# EAGLE design pc_healthypi_move_nRF5340_v2 (EAGLE 9.6.2)
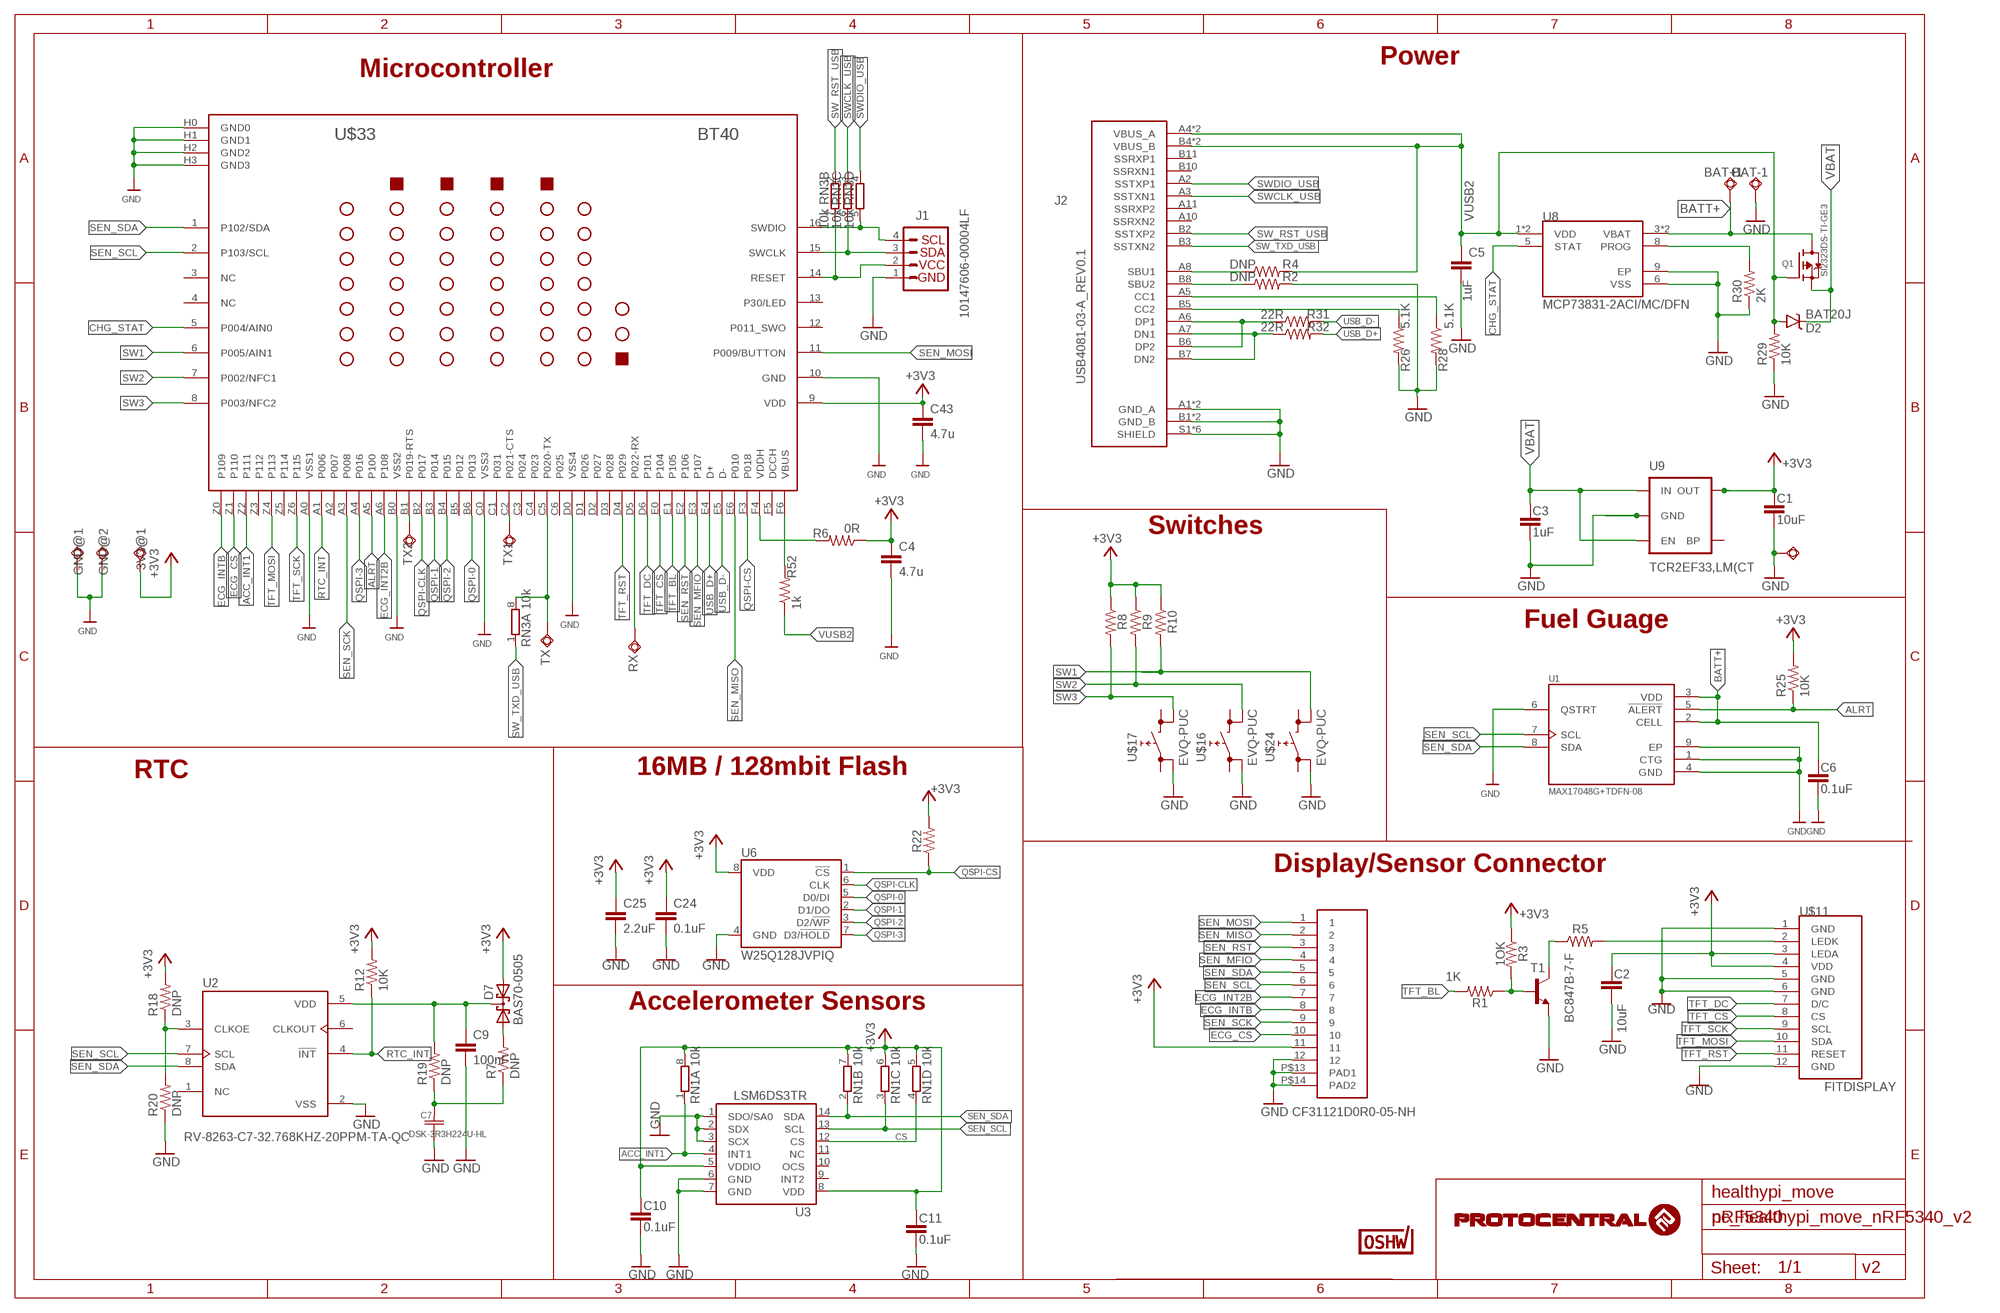
[diagram p0: schematic, sheet 1]

## Parts
3V3@1  TPSQTP13SQ  [TP13SQ]
BAT+1  TPSQTP13SQ  [TP13SQ]
BAT-1  TPSQTP13SQ  [TP13SQ]
C1  10uF  0.1UF-0603-100V-10%  [0603@1]
C2  10uF  0.1UF-0603-100V-10%  [0603@1]
C3  1uF  0.1UF-0402T-6.3V-10%-X7R  [0402-TIGHT]
C4  4.7u  C-EUC0402  [C0402]
C5  1uF  2.2UF-0402_TIGHT-10V-10%-X5R  [0402-TIGHT]
C6  0.1uF  0.1UF-0402T-6.3V-10%-X7R  [0402-TIGHT]
C7  DSK-3R3H224U-HL  [CAP_DSK-3R3H224U-HL_ELN]
C9  100nF  C-EUC0402  [C0402]
C10  0.1uF  0.1UF-0402T-6.3V-10%-X7R  [0402-TIGHT]
C11  0.1uF  0.1UF-0402T-6.3V-10%-X7R  [0402-TIGHT]
C24  0.1uF  0.1UF-0402T-6.3V-10%-X7R  [0402-TIGHT]
C25  2.2uF  2.2UF-0402_TIGHT-10V-10%-X5R  [0402-TIGHT]
C43  4.7u  C-EUC0402  [C0402]
D2  BAT20J  DIODE-SCHOTTKY-BAT20J  [SOD-323]
D7  BAS70-0505  [SOT23]
GND@1  TPSQTP13SQ  [TP13SQ]
GND@2  TPSQTP13SQ  [TP13SQ]
J1  10147606-00004LF  QWIIC_CONNECTORJS-1MM  [JST04_1MM_RA]
J2  USB4081-03-A_REV0.1  [GCT_USB4081-03-A_REV0.1]
Q1  SI2323DS-TI-GE3  MOSFET-P  [SOT23-R]
R1  200  R-US_R0402  [R0402]
R2  DNP  RESISTOR0402-RES  [0402-RES]
R3  200  R-US_R0402  [R0402]
R4  DNP  RESISTOR0402-RES  [0402-RES]
R5  200R  R-US_R0402  [R0402]
R6  0R  RESISTOR0402-RES  [0402-RES]
R7  DNP  R-US_R0402  [R0402]
R8  200  R-US_R0402  [R0402]
R9  200  R-US_R0402  [R0402]
R10  200  R-US_R0402  [R0402]
R12  10K  R-US_R0402  [R0402]
R18  DNP  R-US_R0402  [R0402]
R19  DNP  R-US_R0402  [R0402]
R20  DNP  R-US_R0402  [R0402]
R22  10k  R-US_R0402  [R0402]
R25  10K  RESISTOR0402-RES  [0402-RES]
R26  5.1K  RESISTOR0402-RES  [0402-RES]
R28  5.1K  RESISTOR0402-RES  [0402-RES]
R29  10K  R-US_R0402  [R0402]
R30  2K  R-US_R0402  [R0402]
R31  22R  RESISTOR0402-RES  [0402-RES]
R32  22R  RESISTOR0402-RES  [0402-RES]
R52  1k  RESISTOR0402-RES  [0402-RES]
RN1  10k  4R-N0402ARV341  [4X0402ARV341]
RN3  10k  4R-N0402ARV341  [4X0402ARV341]
RX  TPSQTP13SQ  [TP13SQ]
SWIO6  TPSQTP11R  [TP11R]
T1  BC847B-7-F  MMBT2222ALT1-NPN-SOT23-BEC  [SOT23-BEC]
TX  TPSQTP13SQ  [TP13SQ]
TX1  TPSQTP13SQ  [TP13SQ]
TX2  TPSQTP13SQ  [TP13SQ]
U1  MAX17048G+TDFN-08  [SON50P200X200X80-9N]
U2  RV-8263-C7-32.768KHZ-20PPM-TA-QC  [IC_RV-8263-C7-32.768KHZ-20PPM-TA-QC]
U3  LSM6DS3TR  LSM6DS3  [LGA14L]
U6  W25Q128JVPIQ  W25QXX128MBIT-6X5-SKINNY_CENTER  [WSON-8-6X5-SKINNY_CENTERPAD]
U8  MCP73831-2ACI/MC/DFN  [SON50P200X300X100-9N]
U9  TCR2EF33,LM(CT  V_REG_LDOSMD  [SOT23-5]
U$5  CF31121D0R0-05-NH  [CF31121D0R0-05-NH]
U$9  CERT-SMALL  [CERT-SMALL-SILK]
U$11  FITDISPLAY  [FITDISPLAY]
U$16  EVQ-PUC  [EVQ-PUC]
U$17  EVQ-PUC  [EVQ-PUC]
U$24  EVQ-PUC  [EVQ-PUC]
U$33  BT40  [BT40]

## Nets
+3V3: 3V3@1.TP C1.1 C2.1 C4.1 C10.1 C11.1 C24.1 C25.1 C43.1 D7.2(A2) R3.1 R6.1 R8.1 R9.1 R10.1 R12.2 R18.2 R22.2 R25.2 RN1.5 RN1.6 RN1.7 RN1.8 U3.5(VDDIO) U3.8(VDD) U6.8(VDD) U9.5(OUT) U$5.11 U$11.3(LEDA) U$11.4(VDD) U$33.9(VDD)
ACC_INT1: RN1.1 U3.4(INT1) U$33.Z2(P111)
ALRT: R25.1 U1.5(!ALERT) U$33.A5(P100)
BATT+: BAT+1.TP C6.1 Q1.3(D) U1.2(CELL) U1.3(VDD) U8.3(VBAT) U8.4(VBAT)
CHG_STAT: U8.5(STAT) U$33.5(P004/AIN0)
CS: RN1.4 U3.12(CS)
ECG_CS: U$5.10 U$33.Z1(P110)
ECG_INT2B: U$5.7 U$33.A6(P108)
ECG_INTB: U$5.8 U$33.Z0(P109)
GND: BAT-1.TP C1.2 C2.2 C3.2 C4.2 C5.2 C6.2 C7.1 C9.2 C10.2 C11.2 C24.2 C25.2 C43.2 GND@1.TP GND@2.TP J1.1 J2.A1(GND_A) J2.A12(GND_A) J2.B1(GND_B) J2.B12(GND_B) J2.S1(SHIELD) J2.S2(SHIELD) J2.S3(SHIELD) J2.S4(SHIELD) J2.S5(SHIELD) J2.S6(SHIELD) R2.2 R20.1 R26.2 R28.2 R29.1 R30.1 SWIO6.TP T1.E U1.1(CTG) U1.4(GND) U1.6(QSTRT) U1.9(EP) U2.2(VSS) U3.1(SDO/SA0) U3.2(SDX) U3.3(SCX) U3.6(GND) U3.7(GND) U6.4(GND) U8.6(VSS) U8.9(EP) U9.2(GND) U$5.12 U$5.P$13(PAD1) U$5.P$14(PAD2) U$11.1(GND) U$11.5(GND) U$11.6(GND) U$11.12(GND) U$16.3 U$17.3 U$24.3 U$33.10(GND) U$33.A0(VSS1) U$33.B0(VSS2) U$33.C0(VSS3) U$33.D0(VSS4) U$33.H0(GND0) U$33.H1(GND1) U$33.H2(GND2) U$33.H3(GND3)
N$1: J2.B8(SBU2) R2.1
N$2: J2.A8(SBU1) R4.1
N$3: TX2.TP U$33.B1(P019-RTS)
N$4: J2.B5(CC2) R26.1
N$5: TX1.TP U$33.C2(P021-CTS)
N$6: J2.A5(CC1) R28.1
N$7: R30.2 U8.8(PROG)
N$8: J2.A6(DP1) J2.B6(DP2) R31.1
N$9: J2.A7(DN1) J2.B7(DN2) R32.1
N$18: R5.2 U$11.2(LEDK)
N$21: R5.1 T1.C
N$23: R1.1 R3.2 T1.B
N$25: R52.2 U$33.F6(VBUS)
N$26: R6.2 U$33.F4(VDDH)
N$30: C9.1 D7.3(K1K2) R19.2 U2.5(VDD)
N$31: R18.1 R20.2 U2.3(CLKOE)
N$32: D7.1(A1) R7.2
N$33: C7.2 R7.1 R19.1
QSPI-0: U6.5(D0/DI) U$33.B6(P013)
QSPI-1: U6.2(D1/DO) U$33.B3(P014)
QSPI-2: U6.3(D2/!WP!) U$33.B4(P015)
QSPI-3: U6.7(D3/!HOLD!) U$33.A4(P016)
QSPI-CLK [Clock]: U6.6(CLK) U$33.B2(P017)
QSPI-CS: R22.1 U6.1(!CS!) U$33.F3(P018)
RESET1: J1.2 RN3.7 U$33.14(RESET)
RTC_INT: R12.1 U2.4(!INT) U$33.A1(P006)
SEN_MFIO: U$5.4 U$33.E3(P107)
SEN_MISO: U$5.2 U$33.E6(P010)
SEN_MOSI: U$5.1 U$33.11(P009/BUTTON)
SEN_RST: U$5.3 U$33.E2(P106)
SEN_SCK: U$5.9 U$33.A3(P008)
SEN_SCL: RN1.3 U1.7(SCL) U2.7(SCL) U3.13(SCL) U$5.6 U$33.2(P103/SCL)
SEN_SDA: RN1.2 U1.8(SDA) U2.8(SDA) U3.14(SDA) U$5.5 U$33.1(P102/SDA)
SW1: R10.2 U$24.2 U$33.6(P005/AIN1)
SW2: R9.2 U$16.2 U$33.7(P002/NFC1)
SW3: R8.2 U$17.2 U$33.8(P003/NFC2)
SW_RST_USB: J2.B2(SSTXP2) RN3.2
SW_TXD_USB: J2.B3(SSTXN2) RN3.1
SWCLK1: J1.3 RN3.6 U$33.15(SWCLK)
SWCLK_USB: J2.A3(SSTXN1) RN3.3
SWDIO1: J1.4 RN3.5 U$33.16(SWDIO)
SWDIO_USB: J2.A2(SSTXP1) RN3.4
TFT_BL: R1.2 U$33.E1(P105)
TFT_CS: U$11.8(CS) U$33.E0(P104)
TFT_DC: U$11.7(D/C) U$33.D6(P101)
TFT_MOSI: U$11.10(SDA) U$33.Z4(P113)
TFT_RST: U$11.11(RESET) U$33.D4(P029)
TFT_SCK: U$11.9(SCL) U$33.Z6(P115)
UART_RX: RX.TP U$33.D5(P022-RX)
UART_TX: RN3.8 TX.TP U$33.C5(P020-TX)
USB_D+: R32.2 U$33.E4(D+)
USB_D-: R31.2 U$33.E5(D-)
VBAT: C3.1 D2.C Q1.2(S) U9.1(IN) U9.3(EN)
VUSB2: C5.1 D2.A J2.A4(VBUS_A) J2.A9(VBUS_A) J2.B4(VBUS_B) J2.B9(VBUS_B) Q1.1(G) R4.2 R29.2 R52.1 U8.1(VDD) U8.2(VDD)
Unconnected: J2.A10(SSRXN2) J2.A11(SSRXP2) J2.B10(SSRXN1) J2.B11(SSRXP1) U2.1(NC) U2.6(CLKOUT) U3.9(INT2) U3.10(OCS) U3.11(NC) U9.4(BP) U$16.1 U$16.4 U$17.1 U$17.4 U$24.1 U$24.4 U$33.3(NC) U$33.4(NC) U$33.12(P011_SWO) U$33.13(P30/LED) U$33.A2(P007) U$33.B5(P012) U$33.C1(P031) U$33.C3(P024) U$33.C4(P023) U$33.C6(P025) U$33.D1(P026) U$33.D2(P027) U$33.D3(P028) U$33.F5(DCCH) U$33.Z3(P112) U$33.Z5(P114)

## Notes on the sheet
- Power
- Microcontroller
- Switches
- Fuel Guage
- 16MB / 128mbit Flash
- RTC
- Display/Sensor Connector
- 1OK
- 1K
- Accelerometer Sensors
- CF31121D0R0-05-NH
- healthypi_move
- nRF5340
- v2

## Library data of the parts
3V3@1 BAT+1 BAT-1 GND@1 GND@2 RX SWIO6 TX TX1 TX2 = testpad:TPSQ: Test pad
C1 C2 = SparkFun-Capacitors:0.1UF: 0.1µF ceramic capacitors A capacitor is a passive two-terminal electrical component used to store electrical energy temporarily in an electric field.; PROD_ID: CAP-08390; VALUE: 0.1uF
C3 = SparkFun-Capacitors:0.1UF: 0.1µF ceramic capacitors A capacitor is a passive two-terminal electrical component used to store electrical energy temporarily in an electric field.; PROD_ID: CAP-14993; VALUE: 0.1uF
C4 C9 C43 = rcl:C-EU: CAPACITOR, European symbol; SPICEPREFIX: C
C5 = SparkFun-Capacitors:2.2UF: 2.2µF ceramic capacitors A capacitor is a passive two-terminal electrical component used to store electrical energy temporarily in an electric field.; PROD_ID: CAP-14232; VALUE: 2.2uF
C6 C10 C11 C24 = SparkFun-Capacitors:0.1UF: 0.1µF ceramic capacitors A capacitor is a passive two-terminal electrical component used to store electrical energy temporarily in an electric field.; PROD_ID: CAP-14993
C7 = circuitects:DSK-3R3H224U-HL; COPYRIGHT: Copyright (C) 2023 Ultra Librarian. All rights reserved.; MANUFACTURER_PART_NUMBER: DSK-3R3H224U-HL; MFR_NAME: Elna
C25 = SparkFun-Capacitors:2.2UF: 2.2µF ceramic capacitors A capacitor is a passive two-terminal electrical component used to store electrical energy temporarily in an electric field.; PROD_ID: CAP-14232
D2 = SparkFun-DiscreteSemi:DIODE-SCHOTTKY: Schottky diodes in SFE's production catalog BAT20J 1A 23V 0.62Vf RB751 120mA 40V 0.37Vf PMEG4005EJ 0.5A 40V 0.42Vf MBRA140 1A 40V 0.5Vf B340A 3A 40V SMA; PROD_ID: DIO-11623
D7 = circuitects:BAS70-05: General-purpose Schottky diodes General-purpose Schottky diodes in small Surface-Mounted Device (SMD) plastic packages AAL Eindhoven MK Check availability <https://pricing.snapeda.com/parts/BAS70-05/Diotec/view-part?ref=eda>; AVAILABILITY: In Stock; CHECK_PRICES: https://www.snapeda.com/parts/BAS70-05/Diotec/view-part/?ref=eda; DESCRIPTION: Schottky, SOT-23, 70V, 0.07A, 150C; MF: Diotec; MP: BAS70-05; PACKAGE: SOT-23-3 Diotec; PRICE: None; SNAPEDA_LINK: https://www.snapeda.com/parts/BAS70-05/Diotec/view-part/?ref=snap
J1 = SparkFun-Connectors:QWIIC_CONNECTOR: SparkFun I2C Standard Qwiic Connector An SMD 1mm pitch JST connector makes it easy and quick (get it? Qwiic?) to connect I2C devices to each other. The Qwiic system <http://www.sparkfun.com/qwiic> enables fast and solderless connection between popular platforms and various sensors and actuators. We carry 200mm <https://www.sparkfun.com/products/14204>, 100mm <https://www.sparkfun.com/products/14205>, 50mm <https://www.sparkfun.com/products/14206>, and breadboard friendly <https://www.sparkfun.com/products/14207> Qwiic cables. We also offer 10 pcs strips <https://www.sparkfun.com/products/14323> the SMD connectors.; PROD_ID: CONN-13694; VALUE: QWIIC_RIGHT_ANGLE
J2 = circuitects:USB4081-03-A_REV0.1: Check availability <https://pricing.snapeda.com/parts/USB4081-03-A/Global%20Connector%20Technology/view-part?ref=eda>; AVAILABILITY: In Stock; DESCRIPTION: Type C USB 3.2 Gen 2 Connector; MF: Global Connector Technology; MP: USB4081-03-A; PACKAGE: None; PRICE: None
Q1 = microbuilder:MOSFET-P: P-Channel Mosfet SOT-23 IRLML5103 30V 760mA 1V Vgs - Digikey: IRLML5103PBFCT-ND NTR0202PL 20V 400mA 2.3V Vgs - Digikey: NTR0202PLT1GOSTR-ND NTR4101PT1G 20V 1.8A 1.2V Vgs - Digikey: NTR4101PT1GOSCT-ND DMP2004K 20V 600mA 1V Vgs - Digikey: DMP2004KDICT-ND
R1 R3 R5 R7-R10 R12 R18-R20 R22 R29 R30 = rcl:R-US_: RESISTOR, American symbol; SPICEPREFIX: R
R2 R4 R6 R25 R26 R28 R31 R32 R52 = SparkFun:RESISTOR: Resistor Basic schematic elements and footprints for 0603, 1206, and PTH resistors.
RN1 RN3 = resistor-dil:4R-N: Array Chip Resistor Source: RS Component / Phycomp; OC_FARNELL: unknown; OC_NEWARK: unknown
T1 = transistor:*-NPN-: NPN Transistror BF959 corrected 2008.03.06
U1 = circuitects:MAX17048G+: Micropower 1-Cell/2-Cell Li+ ModelGauge ICs Check availability <https://pricing.snapeda.com/parts/MAX17048G%2B/Analog%20Devices/view-part?ref=eda>; AVAILABILITY: In Stock; DESCRIPTION: 3µA 1-Cell/2-Cell Fuel Gauge with ModelGauge; MF: Analog Devices; MP: MAX17048G+; PACKAGE: TDFN-8 Maxim; PRICE: None; PURCHASE-URL: https://pricing.snapeda.com/search/part/MAX17048G+/?ref=eda
U2 = circuitects:RV-8263-C7-32.768KHZ-20PPM-TA-QC: Check availability <https://pricing.snapeda.com/parts/RV-8263-C7-32.768KHZ-20PPM-TA-QC/Micro%20Crystal/view-part?ref=eda>; AVAILABILITY: In Stock; CHECK_PRICES: https://www.snapeda.com/parts/RV-8263-C7-32.768KHZ-20PPM-TA-QC/Micro+Crystal/view-part/?ref=eda; DESCRIPTION: Real-Time Clock Module in 1.5 x 3.2 mm package; MF: Micro Crystal; MP: RV-8263-C7-32.768KHZ-20PPM-TA-QC; PACKAGE: QFN-8 Micro Crystal; PRICE: None; SNAPEDA_LINK: https://www.snapeda.com/parts/RV-8263-C7-32.768KHZ-20PPM-TA-QC/Micro+Crystal/view-part/?ref=snap
U3 = LSM6DS3:LSM6DS3
U6 = SparkFun-IC-Memory:W25QXX; PROD_ID: IC-15107
U8 = circuitects:MCP73831-2ACI/MC/DFN: MCP73831 Series Single-Cell Li-Ion/Li-Polymer Battery Charge Controller - DFN-8 Check availability <https://pricing.snapeda.com/parts/MCP73831-2ACI/MC/Microchip%20Technology/view-part?ref=eda>; AVAILABILITY: In Stock; DESCRIPTION: Linear Battery Charger Controller Li-Ion/Li-Pol 505mA 4.2V 8-Pin DFN EP Tube; MF: Microchip Technology; MP: MCP73831-2ACI/MC; PACKAGE: None; PRICE: None; PURCHASE-URL: https://pricing.snapeda.com/search/part/MCP73831-2ACI/MC/?ref=eda
U9 = SparkFun-PowerIC:V_REG_LDO: Voltage Regulator LDO Standard 150mA LDO voltage regulator in SOT-23 layout. Micrel part MIC5205. BP (by-pass) pin is used to lower output noise with 470pF cap.; PROD_ID: VREG-12457
U$5 = circuitects:CF31121D0R0-05-NH
U$9 = OSHWA:CERT
U$11 = circuitects:FITDISPLAY
U$16 U$17 U$24 = circuitects:EVQ-PUC
U$33 = circuitects:BT40

## Net classes
2 Clock: width 0.089 mm, clearance 0.178 mm

## Board
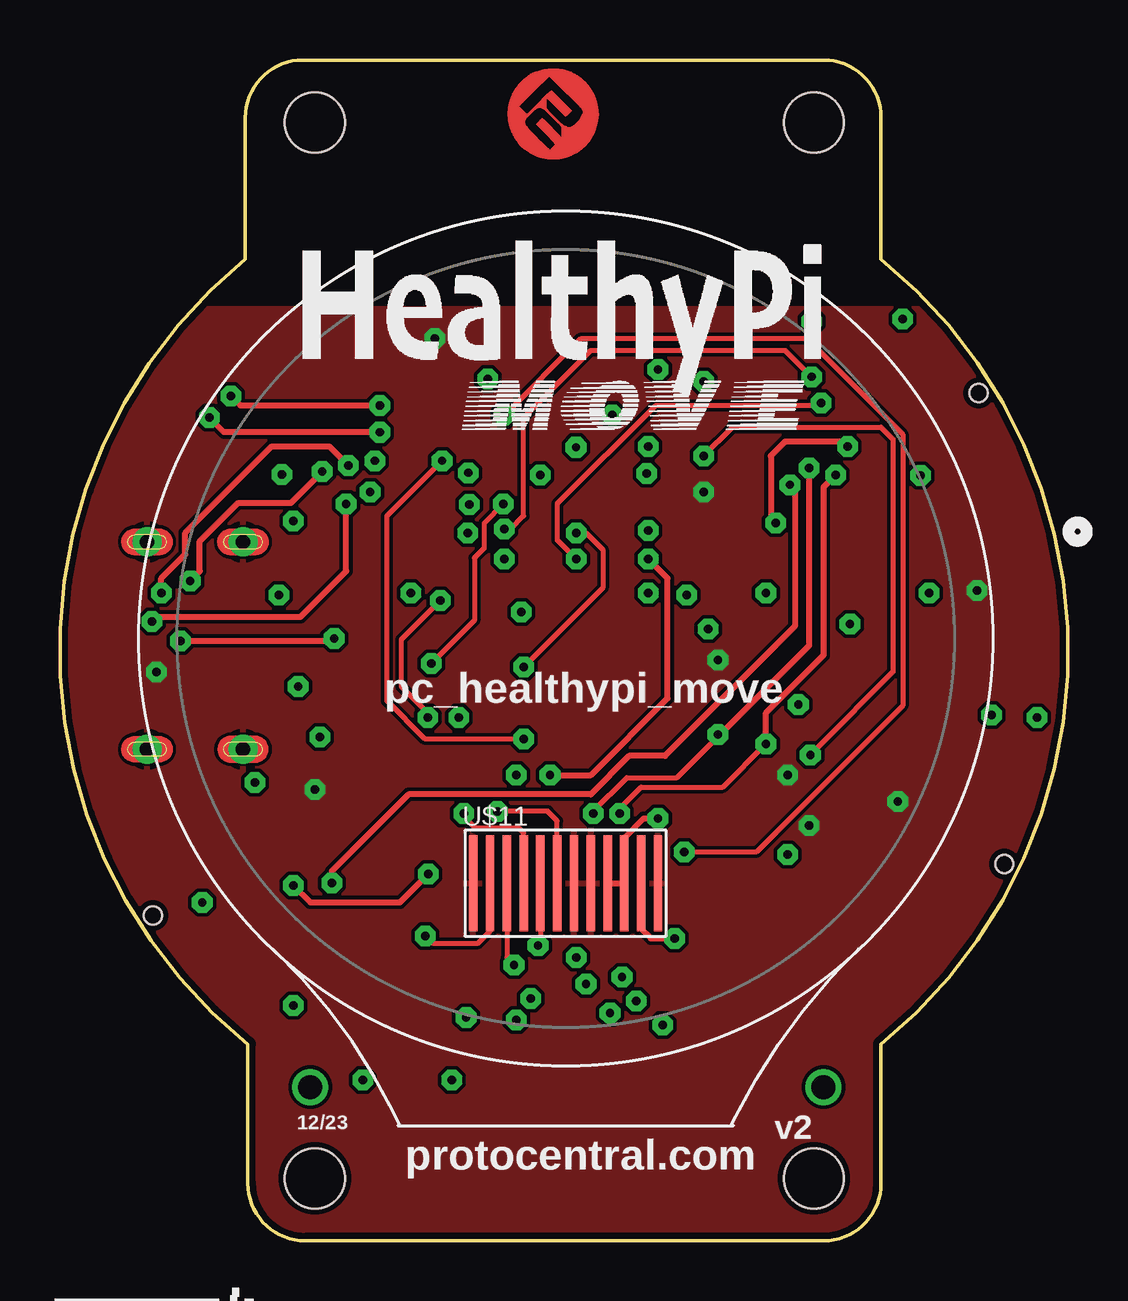
[diagram p1: board, top side]
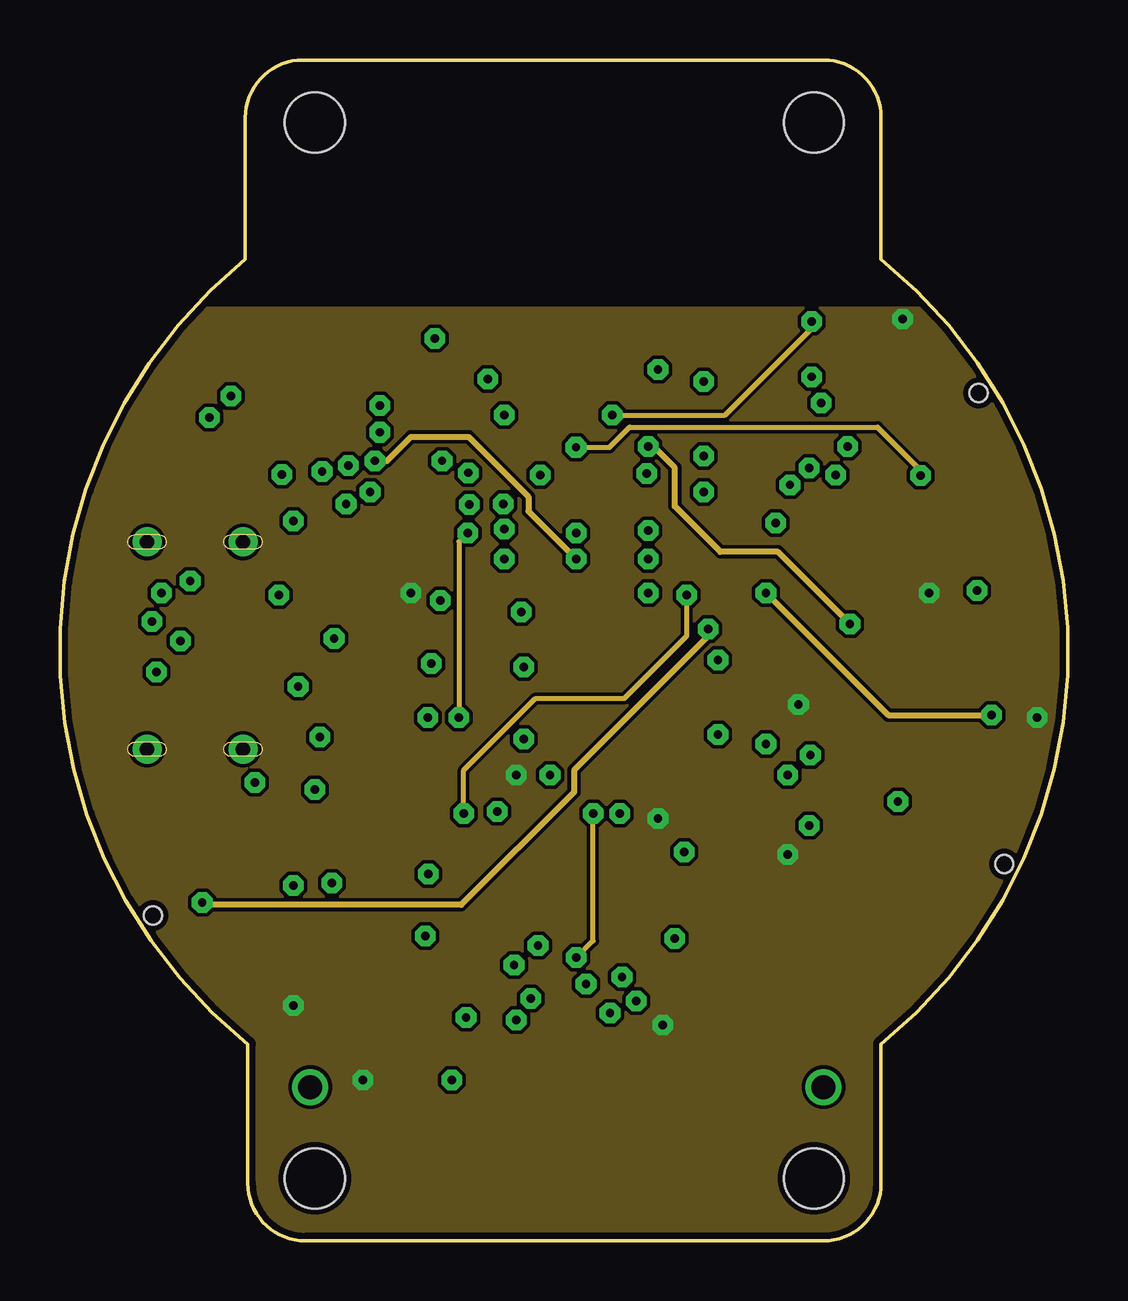
[diagram p2: board, inner layer Route2]
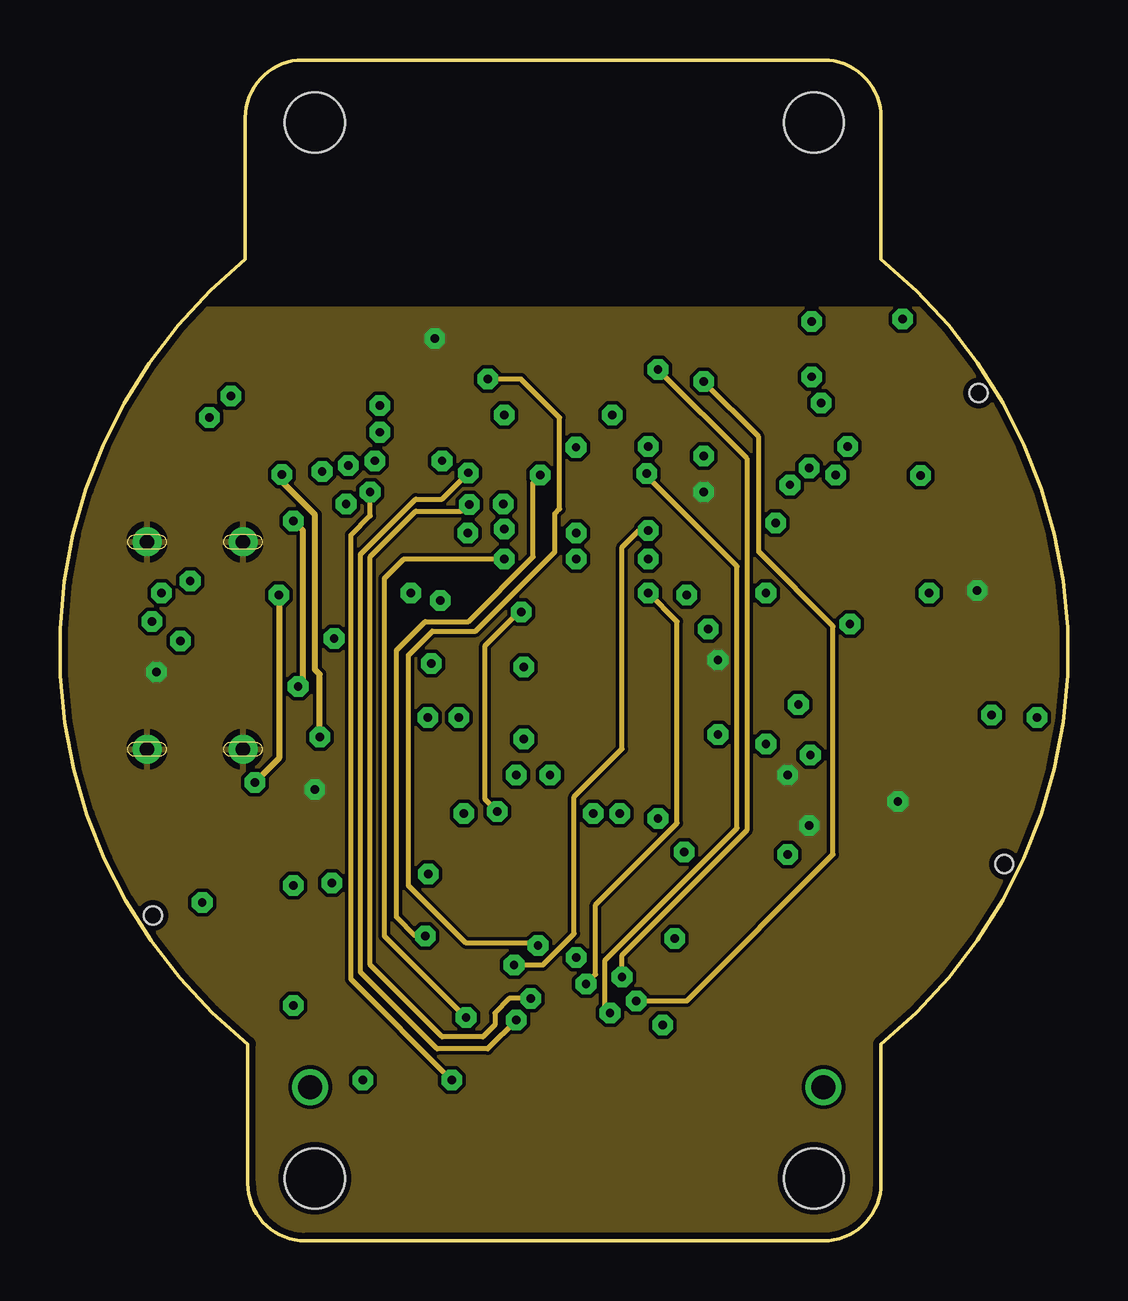
[diagram p3: board, inner layer Route15]
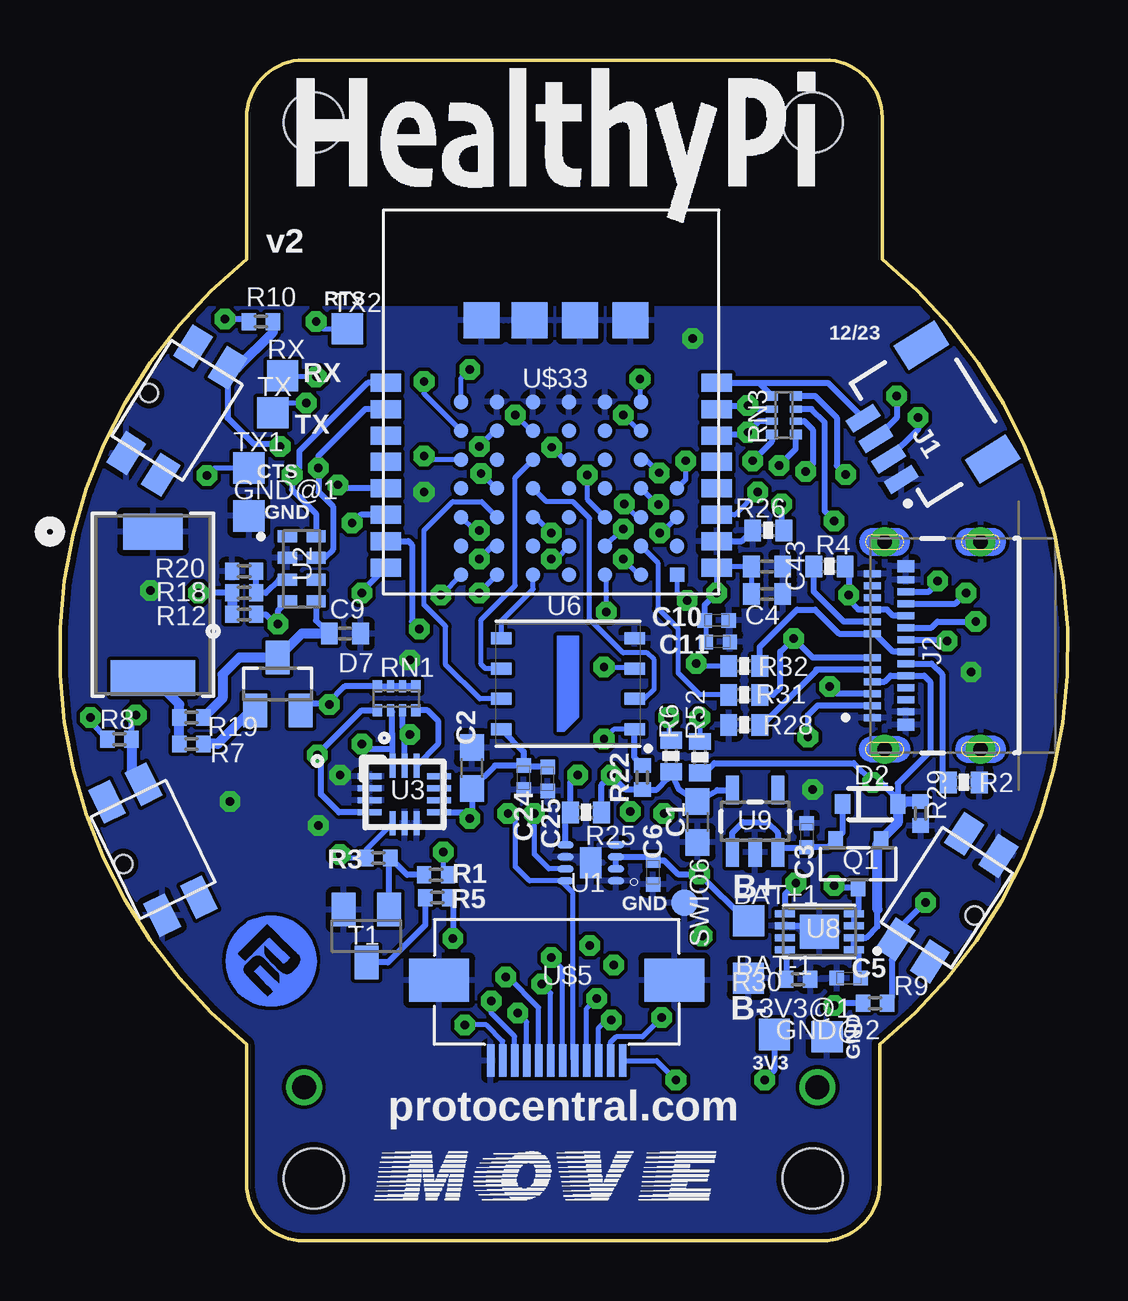
[diagram p4: board, bottom side, seen from below]

Size 42 x 49.2 mm. Coordinates in mm from the lower left corner, seen from the top.
Outline: 31.83,49.2 10.13,49.2 arc90 7.73,46.8 7.73,40.9 arc102 7.83,8.2 7.83,2.4 arc90 10.23,0 31.83,0 arc90 34.23,2.4 34.23,8.2 arc102 34.23,40.9 34.23,46.8 arc90 31.83,49.2
Copper layers (1*2*15*16): Top 0.035mm / dielectric 1.5mm / Route2 0.035mm / dielectric 0.15mm / Route15 0.035mm / dielectric 0.2mm / Bottom 0.035mm
Design rules "Circuitects-Rules *": minimum track width 6mil, minimum drill 0.3mm, track to track 6mil, track to pad 6mil, pad to pad 6mil, via to via 6mil, smd to smd 6mil, copper to edge 10mil, drill to drill 8mil, minimum pad ring 12mil, minimum via ring 10mil, stop-mask expansion 4mil, vias tented up to drill 25mil, thermal gap 10mil
Holes 2.5 mm at 10.63,46.6 31.43,2.6 31.43,46.6 10.63,2.6

### Footprints (pad centres in the part's own frame; a part is rotated, then mirrored left to right if it is on the bottom)
TP13SQ = smd 1.3 x 1.3: TP 0,0
0603@1 = smd 1.1 x 1: 1 -0.85,0; 2 0.85,0
0402-TIGHT = smd 0.6 x 0.6: 1 -0.5,0; 2 0.5,0
C0402 = smd 0.7 x 0.9: 1 -0.65,0; 2 0.65,0
CAP_DSK-3R3H224U-HL_ELN = smd 2.489 x 1.499: 1 0,3.05 | smd 3.505 x 1.499: 2 0,-3.05
SOD-323 = smd 0.63 x 0.83: A 1.15,0; C -1.15,0
SOT23 = smd 1 x 1.4: 1 -0.95,-1.1; 2 0.95,-1.1; 3 0,1.1
JST04_1MM_RA = smd 0.6 x 1.35: 1 -1.5,0; 2 -0.5,0; 3 0.5,0; 4 1.5,0 | smd 1.2 x 2: NC1 2.8,-3.675; NC2 -2.8,-3.675
GCT_USB4081-03-A_REV0.1 = smd 0.3 x 0.7: A1 -3,0.51; A2 -2.5,0.51; A3 -2,0.51; A4 -1.5,0.51; A5 -1,0.51; A6 -0.5,0.51; A7 0.5,0.51; A8 1,0.51; A9 1.5,0.51; A10 2,0.51; A11 2.5,0.51; A12 3,0.51; B1 2.75,-0.89; B2 2.25,-0.89; B3 1.75,-0.89; B4 1.25,-0.89; B5 0.75,-0.89; B6 0.25,-0.89; B7 -0.25,-0.89; B8 -0.75,-0.89; B9 -1.25,-0.89; B10 -1.75,-0.89; B11 -2.25,-0.89; B12 -2.75,-0.89 | drill 0.6 pad 1.1: S1 -4.32,-4; S2 4.32,-4; S3 -4.32,0; S4 4.32,0 | smd 0.5 x 0.7: S5 -3.3,-0.89; S6 3.3,-0.89
SOT23-R = smd 0.6 x 0.7: 1 -0.95,-1; 2 0.95,-1; 3 0,1
R0402 = smd 0.6 x 0.7: 1 -0.5,0; 2 0.5,0
0402-RES = smd 0.7 x 0.9: 1 -0.65,0; 2 0.65,0
4X0402ARV341 = smd 0.4 x 0.5: 1 -0.8,-0.5; 4 0.8,-0.5; 5 0.8,0.5; 8 -0.8,0.5 | smd 0.3 x 0.5: 2 -0.25,-0.5; 3 0.25,-0.5; 6 0.25,0.5; 7 -0.25,0.5
TP11R = smd 1.1 x 1.1: TP 0,0
SOT23-BEC = smd 1 x 1.4: B -0.95,-1.1; C 0,1.1; E 0.95,-1.1
SON50P200X200X80-9N = smd 0.7 x 0.3: 1 -1.05,0.75; 2 -1.05,0.25; 3 -1.05,-0.25; 4 -1.05,-0.75; 5 1.05,-0.75; 6 1.05,-0.25; 7 1.05,0.25; 8 1.05,0.75 | smd 0.9 x 1.3: 9 0,0
IC_RV-8263-C7-32.768KHZ-20PPM-TA-QC = smd 0.8 x 0.5: 1 -0.6,1.35; 2 -0.6,0.45; 3 -0.6,-0.45; 4 -0.6,-1.35; 5 0.6,-1.35; 6 0.6,-0.45; 7 0.6,0.45; 8 0.6,1.35
LGA14L = smd 1 x 0.25: 1 -1.45,0.75; 2 -1.45,0.25; 3 -1.45,-0.25; 4 -1.45,-0.75; 8 1.45,-0.75; 9 1.45,-0.25; 10 1.45,0.25; 11 1.45,0.75 | smd 0.25 x 1: 5 -0.5,-1.2; 6 0,-1.2; 7 0.5,-1.2; 12 0.5,1.2; 13 0,1.2; 14 -0.5,1.2
WSON-8-6X5-SKINNY_CENTERPAD = smd 0.85 x 0.5: 1 -2.775,1.905; 2 -2.775,0.635; 3 -2.775,-0.635; 4 -2.775,-1.905; 5 2.775,-1.905; 6 2.775,-0.635; 7 2.775,0.635; 8 2.775,1.905
SON50P200X300X100-9N = smd 0.84 x 0.27: 1 -1.435,0.75; 2 -1.435,0.25; 3 -1.435,-0.25; 4 -1.435,-0.75; 5 1.435,-0.75; 6 1.435,-0.25; 7 1.435,0.25; 8 1.435,0.75 | smd 1.625 x 1.425: 9 0,0
SOT23-5 = smd 0.55 x 1.2: 1 -0.95,-1.3; 2 0,-1.3; 3 0.95,-1.3; 4 0.95,1.3; 5 -0.95,1.3
CF31121D0R0-05-NH = smd 0.3 x 1.35: 1 -2.75,1.675; 2 -2.25,1.675; 3 -1.75,1.675; 4 -1.25,1.675; 5 -0.75,1.675; 6 -0.25,1.675; 7 0.25,1.675; 8 0.75,1.675; 9 1.25,1.675; 10 1.75,1.675; 11 2.25,1.675; 12 2.75,1.675 | smd 2.5 x 1.8: P$13 -4.9,-1.675; P$14 4.9,-1.675
FITDISPLAY = smd 0.35 x 4: 1 3.85,-10.2; 2 3.15,-10.2; 3 2.45,-10.2; 4 1.75,-10.2; 5 1.05,-10.2; 6 0.35,-10.2; 7 -0.35,-10.2; 8 -1.05,-10.2; 9 -1.75,-10.2; 10 -2.45,-10.2; 11 -3.15,-10.2; 12 -3.85,-10.2
EVQ-PUC = smd 1.55 x 1: 1 2.625,0.85; 2 2.625,-0.85; 3 -2.625,0.85; 4 -2.625,-0.85 | hole 0.75: 0,1.375
BT40 = smd 1.27 x 0.75: 1 -6.9,0.8; 2 -6.9,-0.3; 3 -6.9,-1.4; 4 -6.9,-2.5; 5 -6.9,-3.6; 6 -6.9,-4.7; 7 -6.9,-5.8; 8 -6.9,-6.9; 9 6.9,-6.9; 10 6.9,-5.8; 11 6.9,-4.7; 12 6.9,-3.6; 13 6.9,-2.5; 14 6.9,-1.4; 15 6.9,-0.3; 16 6.9,0.8 | smd 0.6 x 0.6: A0 -2.25,0; A1 -2.25,-1.2; A2 -2.25,-2.4; A3 -2.25,-3.6; A4 -2.25,-4.8; A5 -2.25,-6; A6 -2.25,-7.2; B0 -0.75,0; B1 -0.75,-1.2; B2 -0.75,-2.4; B3 -0.75,-3.6; B4 -0.75,-4.8; B5 -0.75,-6; B6 -0.75,-7.2; C0 0.75,0; C1 0.75,-1.2; C2 0.75,-2.4; C3 0.75,-3.6; C4 0.75,-4.8; C5 0.75,-6; C6 0.75,-7.2; D0 2.25,0; D1 2.25,-1.2; D2 2.25,-2.4; D3 2.25,-3.6; D4 2.25,-4.8; D5 2.25,-6; D6 2.25,-7.2; E0 3.75,0; E1 3.75,-1.2; E2 3.75,-2.4; E3 3.75,-3.6; E4 3.75,-4.8; E5 3.75,-6; E6 3.75,-7.2; F3 5.25,-3.6; F4 5.25,-4.8; F5 5.25,-6; F6 5.25,-7.2; Z0 -3.75,0; Z1 -3.75,-1.2; Z2 -3.75,-2.4; Z3 -3.75,-3.6; Z4 -3.75,-4.8; Z5 -3.75,-6; Z6 -3.75,-7.2 | smd 1.5 x 1.5: H0 -2.9,3.4; H1 -0.9,3.4; H2 1.2,3.4; H3 3.3,3.4

### Placement (x,y rotation side)
3V3@1  12.23,8.6 0 bottom
BAT+1  13.3,13.33 0 bottom
BAT-1  13.31,10.94 0 bottom
C1  15.43,17.45 270 bottom
C2  24.83,19.7 90 bottom
C3  10.88,16.9 90 bottom
C4  12.53,26.95 0 bottom
C5  9.13,10.95 180 bottom
C6  17.28,15.35 270 bottom
C7  38.13,26.5 0 bottom
C9  30.13,25.3 0 bottom
C10  14.63,25.85 0 bottom
C11  14.58,24.95 0 bottom
C24  22.68,19.3 270 bottom
C25  21.68,19.25 270 bottom
C43  12.53,28.1 0 bottom
D2  8.23,18.2 0 bottom
D7  32.93,23.2 0 bottom
GND@1  34.13,30.2 0 bottom
GND@2  10.03,8.5 0 bottom
J1  7.73,33 122 bottom
J2  7.63,24.8 90 bottom
Q1  8.73,15.71 180 bottom
R1  26.33,15.25 0 bottom
R2  4.33,19.1 0 bottom
R3  28.73,15.95 0 bottom
R4  9.93,28.1 0 bottom
R5  26.28,14.3 0 bottom
R6  16.53,20.2 90 bottom
R7  36.53,20.7 0 bottom
R8  39.53,20.9 0 bottom
R9  8.03,9.9 0 bottom
R10  33.63,38.3 0 bottom
R12  34.33,26.1 180 bottom
R18  34.33,27 180 bottom
R19  36.53,21.8 0 bottom
R20  34.33,27.9 0 bottom
R22  17.73,19.3 270 bottom
R25  20.08,17.85 0 bottom
R26  12.48,29.6 180 bottom
R28  13.48,21.5 180 bottom
R29  6.13,17.8 90 bottom
R30  11.23,10.9 180 bottom
R31  13.48,22.75 180 bottom
R32  13.48,23.95 180 bottom
R52  15.33,20.15 90 bottom
RN1  27.98,22.6 0 bottom
RN3  11.83,34.4 90 bottom
RX  32.73,36.05 0 bottom
SWIO6  15.98,14.08 0 bottom
T1  29.23,12.7 180 bottom
TX  33.13,34.5 0 bottom
TX1  34.13,32.2 0 bottom
TX2  30.03,38 0 bottom
U1  19.88,15.75 180 bottom
U2  31.93,28 0 bottom
U3  27.65,18.6 0 bottom
U6  20.83,23.21 180 bottom
U8  10.35,12.88 180 bottom
U9  13.03,17.48 0 bottom
U$1  [HEALTHYPI_MOVE_LOGO]  32.13,39.1 0 bottom
U$5  21.3,9.18 180 bottom
U$6  [HEALTHYPI_MOVE_LOGO_1]  15.93,31.2 0 top
U$9  3.93,-6.3 0 top  (outside the outline)
U$10  [HEALTHYPI_MOVE_LOGO_1]  29.73,-0.9 0 bottom
U$11  21.08,25.1 0 top
U$13  [HEALTHYPI_MOVE_LOGO]  10.13,31.9 0 top
U$14  [PCROUNDLOGO_GOLD]  36.03,9.4 0 bottom
U$15  [PCROUNDLOGO_GOLD]  17.73,44.7 0 top
U$16  5.03,14.3 237 bottom
U$17  38.13,16.3 116 bottom
U$24  37.13,34.6 58 bottom
U$33  21.53,34.95 0 bottom

### Tracks (layer width: path | path; a pad name or v marks a point on that pad's centre or on a via)
+3V3  (via drill 0.35)
  Top 0.254: U$11.4 U$11.3 23.53,16.8 24.33,17.6 v24.93,17.6
  Bottom 0.2: U$33.9 14.68,28.1 C43.1 C4.1 | C10.1 15.08,25.8 C11.1 | U3.5 29.23,16.32 R3.1 30.18,15.95 v30.33,16.1 | v25.13,9 24.23,9 23.55,8.32 U$5.11
  Bottom 0.254: U9.5 14.6,18.78 C1.1 16.19,18.8 R6.1 16.68,19.4 16.68,19.25 17.13,18.8 R22.2 18.43,18.8 v19.03,19.4 19.43,19 R25.2 | U6.8 22.68,20.38 C24.1 | C25.1 22.63,19.75 C24.1 | RN1.5 RN1.6 RN1.7 RN1.8 30.13,23.1 30.83,22.4 | U3.8 25.18,17.85 v24.93,17.6 24.83,17.7 C2.1 23.88,19.8 C24.1 | U$33.9 v14.63,27 15.13,26.5 C10.1 | v12.63,6.7 12.23,7.1 3V3@1.TP | R8.1 40.73,21.6 v40.73,21.8 | D7.2 31.68,22.4 30.83,22.4 | 30.83,22.4 v30.78,22.35 | R9.1 9.63,9.9 v9.73,9.8 | R18.2 v36.23,27 | R10.1 34.23,38.4 v35.13,38.4
  Bottom 0.406: R18.2 R12.2
  pour Route2: 42.18,38.85 -0.22,38.85 -0.22,-0.1 42.18,-0.1
ACC_INT1  (via drill 0.35)
  Top 0.2: v26.83,32.7 28.03,33.9 34.23,33.9 34.73,33.4 34.73,23.7 31.58,20.55 v31.28,20.25
  Bottom 0.2: U$33.Z2 26.68,32.55 v26.83,32.7
  Bottom 0.254: U3.4 30.38,17.85 31.13,18.6 31.13,20.1 v31.28,20.25 29.43,22.1 RN1.1
ALRT  (via drill 0.35)
  Top 0.254: v20.43,19.4 22.13,19.4 25.33,22.6 25.33,27.6 v24.53,28.4
  Bottom 0.254: U1.5 20.93,17.65 R25.1 20.73,19.1 v20.43,19.4 | U$33.A5 23.98,28.95 v24.53,28.4
BATT+  (via drill 0.35)
  Top 0.254: v9.73,14.8 10.43,14.1 14.17,14.1 v15.35,15.28
  Bottom 0.254: U8.3 U8.4 8.73,13.82 Q1.3 9.64,14.71 v9.73,14.8 | U1.2 U1.3 17.43,16 C6.1 16.82,15.85 16.25,15.28 v15.35,15.28 13.4,13.33 BAT+1.TP
CHG_STAT  (via drill 0.35)
  Top 0.254: v11.33,14.9 11.33,15.4 14.53,18.6 22.13,18.6 23.73,20.2 25.23,20.2 30.63,25.6 30.63,31.3 v30.43,31.5
  Bottom 0.254: U$33.5 30.28,31.35 v30.43,31.5 | v11.33,14.9 11.78,14.45 U8.5
CS
  Bottom 0.254: U3.12 26.25,20.7 26.25,21.67 26.68,22.1 RN1.4
ECG_CS  (via drill 0.35)
  Route15 0.2: v24.03,10 26.13,10 32.23,16.1 32.23,25.6 29.13,28.7 29.13,33.5 v26.83,35.8
  Bottom 0.2: U$5.10 23.05,8.52 24.03,9.5 v24.03,10 | v26.83,35.8 26.83,35.3 U$33.Z1
ECG_INT2B  (via drill 0.35)
  Route15 0.2: v21.93,10.7 22.33,11.1 22.33,14 25.73,17.4 25.73,25.8 v24.53,27
  Bottom 0.2: U$5.7 21.55,10.32 v21.93,10.7 | v24.53,27 U$33.A6
ECG_INTB  (via drill 0.35)
  Route15 0.2: v23.43,11 23.43,11.9 28.63,17.1 28.63,32.6 v24.93,36.3
  Bottom 0.2: U$5.8 22.05,9.72 23.33,11 v23.43,11 | v24.93,36.3 25.28,35.95 U$33.Z0
GND  (via drill 0.35)
  Bottom 0.254: U$33.10 13.58,29.15 R26.2 | U8.6 10.6,13.13 U8.9
  other vias: 30.33,19.4 34.93,18.3 26.83,31.2 15.63,37.6 4.03,23.7 31.23,17.3 27.43,24.2 38.23,27.1 10.63,18.8
  pour Bottom: 42.18,-0.1 -0.22,-0.1 -0.22,38.88 42.18,38.88
  pour Top: 42.18,-0.1 -0.22,-0.1 -0.22,38.88 42.18,38.88
  pour Route15: 42.18,38.85 -0.22,38.85 -0.22,-0.1 42.18,-0.1
N$1
  Bottom 0.254: J2.B8 5.68,24.05 5.23,23.6 5.23,19.45 4.93,19.15 R2.1
N$2
  Bottom 0.254: R4.1 10.58,27.05 9.33,25.8 J2.A8
N$3  (via drill 0.35)
  Route2 0.2: v23.03,34.4 27.73,34.4 31.33,38 v31.33,38.3
  Bottom 0.2: U$33.B1 22.38,33.75 v23.03,34.4 | v31.33,38.3 31.03,38 TX2.TP
N$4  (via drill 0.35)
  Top 0.254: v3.83,25.8 4.03,26 10.03,26 11.93,27.9 v11.93,30.7
  Bottom 0.254: v11.93,30.7 11.93,29.7 R26.1 | J2.B5 5.68,25.55 5.43,25.8 v3.83,25.8
N$5  (via drill 0.35)
  Route2 0.2: v21.51,33.06 22.91,33.06 23.75,33.9 34.08,33.9 35.88,32.09 v35.88,31.89
  Bottom 0.2: U$33.C2 20.98,32.55 21.49,33.06 v21.51,33.06 | v35.88,31.89 35.58,32.2 TX1.TP
N$6
  Bottom 0.254: R28.1 12.73,21.5 10.48,23.75 10.48,23.8 J2.A5
N$7
  Bottom 0.254: U8.8 11.73,12.07 R30.2
N$8  (via drill 0.35)
  Top 0.254: v5.03,25 11.33,25 v11.43,25.1
  Bottom 0.254: R31.1 12.28,22.75 11.98,23.05 11.98,24.55 v11.43,25.1 10.63,24.3 J2.A6 | J2.B6 5.08,25.05 v5.03,25
N$9
  Bottom 0.254: R32.1 12.83,24.75 11.28,26.3 10.53,26.3 9.53,25.3 J2.A7 8.03,25.3 7.28,24.55 J2.B7
N$18  (via drill 0.35)
  Top 0.254: U$11.2 24.23,13 24.63,12.6 v25.63,12.6
  Bottom 0.254: R5.2 25.63,14.15 v25.63,12.6
N$21
  Bottom 0.254: R5.1 26.78,13.15 28.33,11.6 T1.C
N$23
  Bottom 0.254: T1.B 28.28,15.9 R3.2 27.53,15.25 R1.1
N$25  (via drill 0.35)
  Top 0.2: v15.85,26.67 14.23,25.05 14.23,23.1 15.33,22 v15.33,21.8
  Bottom 0.2: U$33.F6 16.28,27.05 15.88,26.65 v15.85,26.67 | v15.33,21.8 R52.2
N$26  (via drill 0.35)
  Route2 0.2: v17,29.5 16.63,29.13 v16.63,21.8
  Bottom 0.2: U$33.F4 16.83,29.6 16.93,29.6 17,29.53 v17,29.5 | v16.63,21.8 16.63,20.95 R6.2
N$28  (via drill 1)
  other vias: 31.83,6.4
N$29  (via drill 1)
  other vias: 10.43,6.4
N$30
  Bottom 0.254: U2.5 31.33,25.85 C9.1
  Bottom 0.406: C9.1 31.93,25.3 D7.3 34.53,24.3 35.23,23.6 35.23,22.6 R19.2
N$31
  Bottom 0.254: U2.3 32.88,27.55 33.43,27 R18.1 R20.2
N$32
  Bottom 0.406: D7.1 34.03,22.1 35.43,20.7 R7.2
N$33
  Bottom 0.406: R7.1 R19.1 37.03,22.35 C7.2
QSPI-0
  Bottom 0.2: U6.5 23.6,25.83 22.28,27.15 U$33.B6
QSPI-1
  Bottom 0.2: U6.2 17.65,22.58 17.23,23 17.23,24.2 17.53,24.5 18.53,24.5 19.93,25.9 19.93,30.1 20.63,30.8 21.73,30.8 U$33.B3
QSPI-2  (via drill 0.35)
  Top 0.2: v21.53,29.5 21.93,29.5 22.63,28.8 22.63,27.2 v19.33,23.9
  Bottom 0.2: U$33.B4 22.18,30.15 v21.53,29.5 | v19.33,23.9 18.11,23.9 U6.3
QSPI-3
  Bottom 0.2: U6.7 24.5,22.58 25.93,24 25.93,25.6 26.83,26.5 26.83,29.6 25.63,30.8 24.43,30.8 U$33.A4
QSPI-CLK
  Bottom 0.2: U6.6 24.27,23.84 24.45,24.02 24.45,25.88 23.03,27.3 23.03,31.8 U$33.B2
QSPI-CS  (via drill 0.35)
  Top 0.2: v19.33,20.9 15.23,20.9 13.63,22.5 13.63,30.2 v15.93,32.5
  Bottom 0.2: U6.1 18.92,21.3 v19.33,20.9 | v15.93,32.5 15.93,31.7 U$33.F3
  Bottom 0.254: R22.1 18.05,20.12 U6.1
RESET1  (via drill 0.35)
  Top 0.254: v13.33,33.69 6.84,33.69 v6.23,34.3
  Bottom 0.254: U$33.14 14.58,33.6 13.42,33.6 v13.33,33.69 12.87,34.15 RN3.7 | v6.23,34.3 6.23,33.81 J1.2
RTC_INT  (via drill 0.35)
  Route2 0.254: v32.93,25.7 29.93,28.7 27.53,28.7 25.63,30.6 25.63,32.2 24.63,33.2 v24.53,33.1
  Bottom 0.254: 32.58,26.65 U2.4 32.93,26.25 v32.93,25.7 33.03,25.7 33.43,26.1 R12.1 | v24.53,33.1 23.88,33.75 U$33.A1
SEN_MFIO  (via drill 0.35)
  Route15 0.2: v19.63,10.1 18.73,10.1 18.13,9.5 18.13,9 17.63,8.5 15.93,8.5 12.93,11.5 12.93,28.5 14.83,30.4 16.73,30.4 17.03,30.7 v17.06,30.67
  Bottom 0.2: U$5.4 20.05,9.68 v19.63,10.1 | v17.06,30.67 17.1,30.67 U$33.E3
SEN_MISO  (via drill 0.35)
  Route15 0.2: v18.53,28.4 14.33,28.4 13.53,27.6 13.53,12.7 v16.93,9.3
  Bottom 0.2: U$5.2 19.05,8.28 18.83,8.5 17.73,8.5 v16.93,9.3 | v18.53,28.4 17.88,27.75 U$33.E6
SEN_MOSI  (via drill 0.35)
  Route15 0.2: v16.33,6.7 12.13,10.9 12.13,29.4 12.93,30.2 v12.93,31.2
  Bottom 0.2: U$5.1 17.13,7.51 v16.33,6.7 | v12.93,31.2 13.88,30.25 U$33.11
SEN_RST  (via drill 0.35)
  Route15 0.2: v19.03,9.2 17.83,8 15.73,8 12.53,11.2 12.53,28.6 14.83,30.9 15.93,30.9 v17.03,32
  Bottom 0.2: U$5.3 19.55,8.88 19.23,9.2 v19.03,9.2 | U$33.E2 17.58,32.55 v17.03,32
SEN_SCK  (via drill 0.35)
  Route15 0.2: v22.93,9.5 22.73,9.7 22.73,11.7 28.23,17.2 28.23,28.1 24.43,31.9 24.43,31.95 v24.45,31.98
  Bottom 0.2: U$5.9 22.55,9.12 v22.93,9.5 | v24.45,31.98 23.82,31.35 U$33.A3
SEN_SCL  (via drill 0.35)
  Top 0.2: v22.23,17.8 22.23,17.9 23.63,19.3 25.73,19.3 27.53,21.1
  Top 0.254: v31.23,32.2 31.23,24.8 27.53,21.1 v27.43,21.1
  Route2 0.2: v21.53,11.8 22.23,12.5 v22.23,17.8
  Bottom 0.2: U1.7 21.63,15.5 22.23,16.1 v22.23,17.8 | U$5.6 21.05,11.32 v21.53,11.8
  Bottom 0.254: U$33.2 29.28,34.65 31.23,32.7 v31.23,32.2 31.23,31.2 30.63,30.6 30.63,28.8 30.98,28.45 U2.7 | RN1.3 27.73,21.4 v27.43,21.1 27.65,20.88 U3.13
SEN_SDA  (via drill 0.35)
  Top 0.2: v23.33,17.8 23.33,18 24.23,18.9 27.63,18.9 v29.43,20.7
  Top 0.254: v32.33,31.9 31.83,31.4 31.83,24.4 29.43,22 v29.43,20.7
  Bottom 0.2: U1.8 21.13,15 | 21.13,15 22.43,15 23.03,15.6 23.03,17.5 v23.33,17.8 | U$5.5 20.63,7.58 20.63,14.5 21.13,15
  Bottom 0.254: U3.14 28.15,20.5 | 28.15,20.5 28.15,21.12 28.16,21.13 28.16,22.03 RN1.2 | U$33.1 29.18,35.75 32.03,32.9 32.03,32.2 v32.33,31.9 32.33,31.3 31.33,30.3 U2.8 | v29.43,20.7 29.23,20.5 28.15,20.5
SW1  (via drill 0.35)
  Top 0.254: v32.83,33.1 32.63,33.3 30.23,33.3 29.63,32.7 29.63,30.1 v29.83,29.9
  Bottom 0.254: U$33.6 29.48,30.25 v29.83,29.9 | U$24.2 35.02,34.29 33.93,33.2 32.93,33.2 v32.83,33.1
  Bottom 0.406: U$24.2 34.62,36.38 33.13,37.86 R10.2
SW2  (via drill 0.35)
  Route2 0.254: v27.03,25.5 27.03,25.2 21.43,19.6 21.43,18.7 16.73,14 6.03,14 v5.93,14.1
  Bottom 0.254: R9.2 7.33,10.1 7.33,11.7 7.17,11.86 U$16.2 7.17,12.86 v5.93,14.1 | U$33.7 27.48,29.15 27.33,29 27.33,25.8 v27.03,25.5
SW3  (via drill 0.35)
  Route2 0.254: v29.43,27 34.53,21.9 v38.83,21.9
  Bottom 0.254: U$33.8 29.43,27.05 v29.43,27 | v38.83,21.9 39.03,21.7 R8.2
  Bottom 0.406: U$17.2 39.02,19.53 39.02,20.59 39.03,20.6 R8.2
SW_RST_USB  (via drill 0.35)
  Top 0.254: v5.43,27.5 5.83,27.9 5.83,29.15 7.43,30.75 9.63,30.75 v10.93,32.05
  Bottom 0.254: J2.B2 5.78,27.05 5.43,27.4 v5.43,27.5 | RN3.2 10.98,34.15 10.63,33.8 10.63,32.35 v10.93,32.05
SW_TXD_USB  (via drill 0.35)
  Top 0.254: v4.23,27 4.23,27.6 5.23,28.6 5.23,29.5 8.83,33.1 11.23,33.1 v12.03,32.3
  Bottom 0.254: J2.B3 4.68,26.55 v4.23,27 | v12.03,32.3 11.33,33 RN3.1
SWCLK1  (via drill 0.35)
  Top 0.254: v13.33,34.8 7.53,34.8 v7.13,35.2
  Bottom 0.254: U$33.15 14.48,34.8 v13.33,34.8 13.18,34.65 RN3.6 | v7.13,35.2 7.13,34.29 J1.3
SWCLK_USB  (via drill 0.35)
  Route15 0.254: v9.93,23.09 10.13,23.29 10.13,29.6 v9.73,30
  Bottom 0.254: J2.A3 9.63,22.8 v9.92,23.09 v9.93,23.09 | v9.73,30 10.13,30.4 10.13,34.1 10.68,34.65 RN3.3
SWDIO1
  Bottom 0.254: U$33.16 12.88,35.75 | 12.88,35.75 RN3.5 | 12.88,35.75 10,35.75 J1.4
SWDIO_USB  (via drill 0.35)
  Route15 0.254: v10.83,21 10.83,23.6 10.63,23.8 10.63,30.25 9.25,31.62 v9.25,31.92
  Bottom 0.254: J2.A2 10.43,22.3 10.83,21.9 v10.83,21 | RN3.4 10.53,35.2 9.63,34.3 9.63,32.3 v9.25,31.92
TFT_BL  (via drill 0.35)
  Top 0.2: v18.53,34.4 21.73,37.6 31.13,37.6 35.13,33.6 35.13,22.3 29.03,16.2 v26.03,16.2
  Bottom 0.2: U$33.E1 17.88,33.75 v18.53,34.4 | v26.03,16.2 26.03,15.45 R1.2
TFT_CS  (via drill 0.35)
  Top 0.2: U$11.8 20.03,12.4 v19.93,12.3
  Route15 0.2: v19.93,12.3 19.83,12.4 16.93,12.4 14.53,14.8 14.53,24.4 15.53,25.4 17.33,25.4 20.63,28.7 20.63,30.3 20.83,30.5 20.83,34.3 19.23,35.9 v17.83,35.9
  Bottom 0.2: v17.83,35.9 17.83,35 U$33.E0
TFT_DC  (via drill 0.35)
  Top 0.2: U$11.7 20.73,17.5 20.33,17.9 v18.23,17.9 v18.23,17.89
  Route15 0.2: v18.23,17.89 17.73,18.39 17.73,24.8 19.13,26.2 v19.23,26.2
  Bottom 0.2: v19.23,26.2 19.23,27.7 U$33.D6
TFT_MOSI  (via drill 0.35)
  Top 0.2: U$11.10 18.63,11.8 v18.93,11.5
  Route15 0.2: v18.93,11.5 20.13,11.5 21.43,12.8 21.43,18.5 23.43,20.5 23.43,28.9 24.13,29.6 v24.53,29.6
  Bottom 0.2: v24.53,29.6 24.73,29.6 U$33.Z4
TFT_RST  (via drill 0.35)
  Top 0.2: v15.23,12.7 15.53,12.4 17.43,12.4 17.93,12.9 U$11.11
  Route15 0.2: v15.23,12.7 14.83,12.7 14.03,13.5 14.03,24.6 15.23,25.8 17.03,25.8 19.73,28.5 19.73,31.6 v20.03,31.9
  Bottom 0.2: v20.03,31.9 20.03,30.9 U$33.D4
TFT_SCK  (via drill 0.35)
  Top 0.2: U$11.9 19.33,17 19.13,17.2 17.33,17.2 16.83,17.7 v16.83,17.8
  Route2 0.2: v16.83,17.8 16.83,19.6 19.83,22.6 23.53,22.6 26.13,25.2 v26.13,26.9
  Bottom 0.2: U$33.Z6 v26.13,26.9
UART_RX  (via drill 0.35)
  Top 0.2: v18.53,29.65 18.78,29.65 19.33,30.2 19.33,34.3 22.13,37.1 30.23,37.1 v31.33,36
  Bottom 0.2: U$33.D5 18.63,29.6 18.53,29.6 v18.53,29.65 | v31.33,36 32.68,36 RX.TP
UART_TX  (via drill 0.35)
  Top 0.2: v31.73,34.9 31.63,34.8 24.83,34.8 20.73,30.7 20.73,29.2 v21.53,28.4
  Route2 0.254: v13.13,32.5 13.63,32.5 14.63,33.5 17.03,33.5 19.53,31 19.53,30.4 v21.53,28.4
  Bottom 0.2: U$33.C5 21.33,28.4 v21.53,28.4 | v31.73,34.9 32.73,34.9 TX.TP
  Bottom 0.254: RN3.8 12.33,33.3 v13.13,32.5
USB_D+  (via drill 0.35)
  Top 0.2: v18.48,30.7 17.68,29.9 17.68,28.85 17.28,28.45 17.28,25.85 v15.48,24.05
  Bottom 0.2: U$33.E4 17.93,30.15 v18.48,30.7 | v15.48,24.05 15.38,23.95 R32.2
USB_D-
  Bottom 0.2: U$33.E5 17.08,28.25 17.08,26.35 16.23,25.5 16.23,23.65 15.33,22.75 R31.2
VBAT
  Bottom 0.254: D2.C 9.38,17.01 Q1.2 9.99,16.4 C3.1 10.9,16.38 11.88,16.38 U9.3 12.08,17 12.53,17.45 13.53,17.45 13.98,17 U9.1
VUSB2  (via drill 0.35)
  Route15 0.254: v8.13,19.1 9.13,20.1 v9.13,26.9
  Bottom 0.254: J2.B4 7.28,26.05 7.53,26.3 J2.A9 8.73,26.3 9.13,26.7 v9.13,26.9 9.13,27.95 R4.2 | J2.A4 7.63,23.3 7.38,23.55 J2.B9 5.98,23.55 5.73,23.3 5.73,20.4 7.08,19.05 7.08,18.4 | 7.08,18.4 D2.A | 7.08,18.4 7.78,19.1 v8.13,19.1 8.93,19.9 14.73,19.9 15.13,19.5 R52.1 | 7.93,13.8 7.93,13.1 8.4,12.63 U8.2 U8.1 8.71,11.93 8.71,10.98 C5.1
  Bottom 0.406: R29.2 6.78,18.3 6.88,18.2 D2.A 7.08,17.41 Q1.1 7.93,16.56 7.93,13.8

### Text on the board
tPlace: pc_healthypi_move | 12/23 | v2 | protocentral.com
bPlace: v2 | RTS | 12/23 | RX | TX | CTS | GND | U3 | B+ | GND | B- | GND | 3V3 | protocentral.com